# EAGLE design LED Sockel (EAGLE 7.4.0)
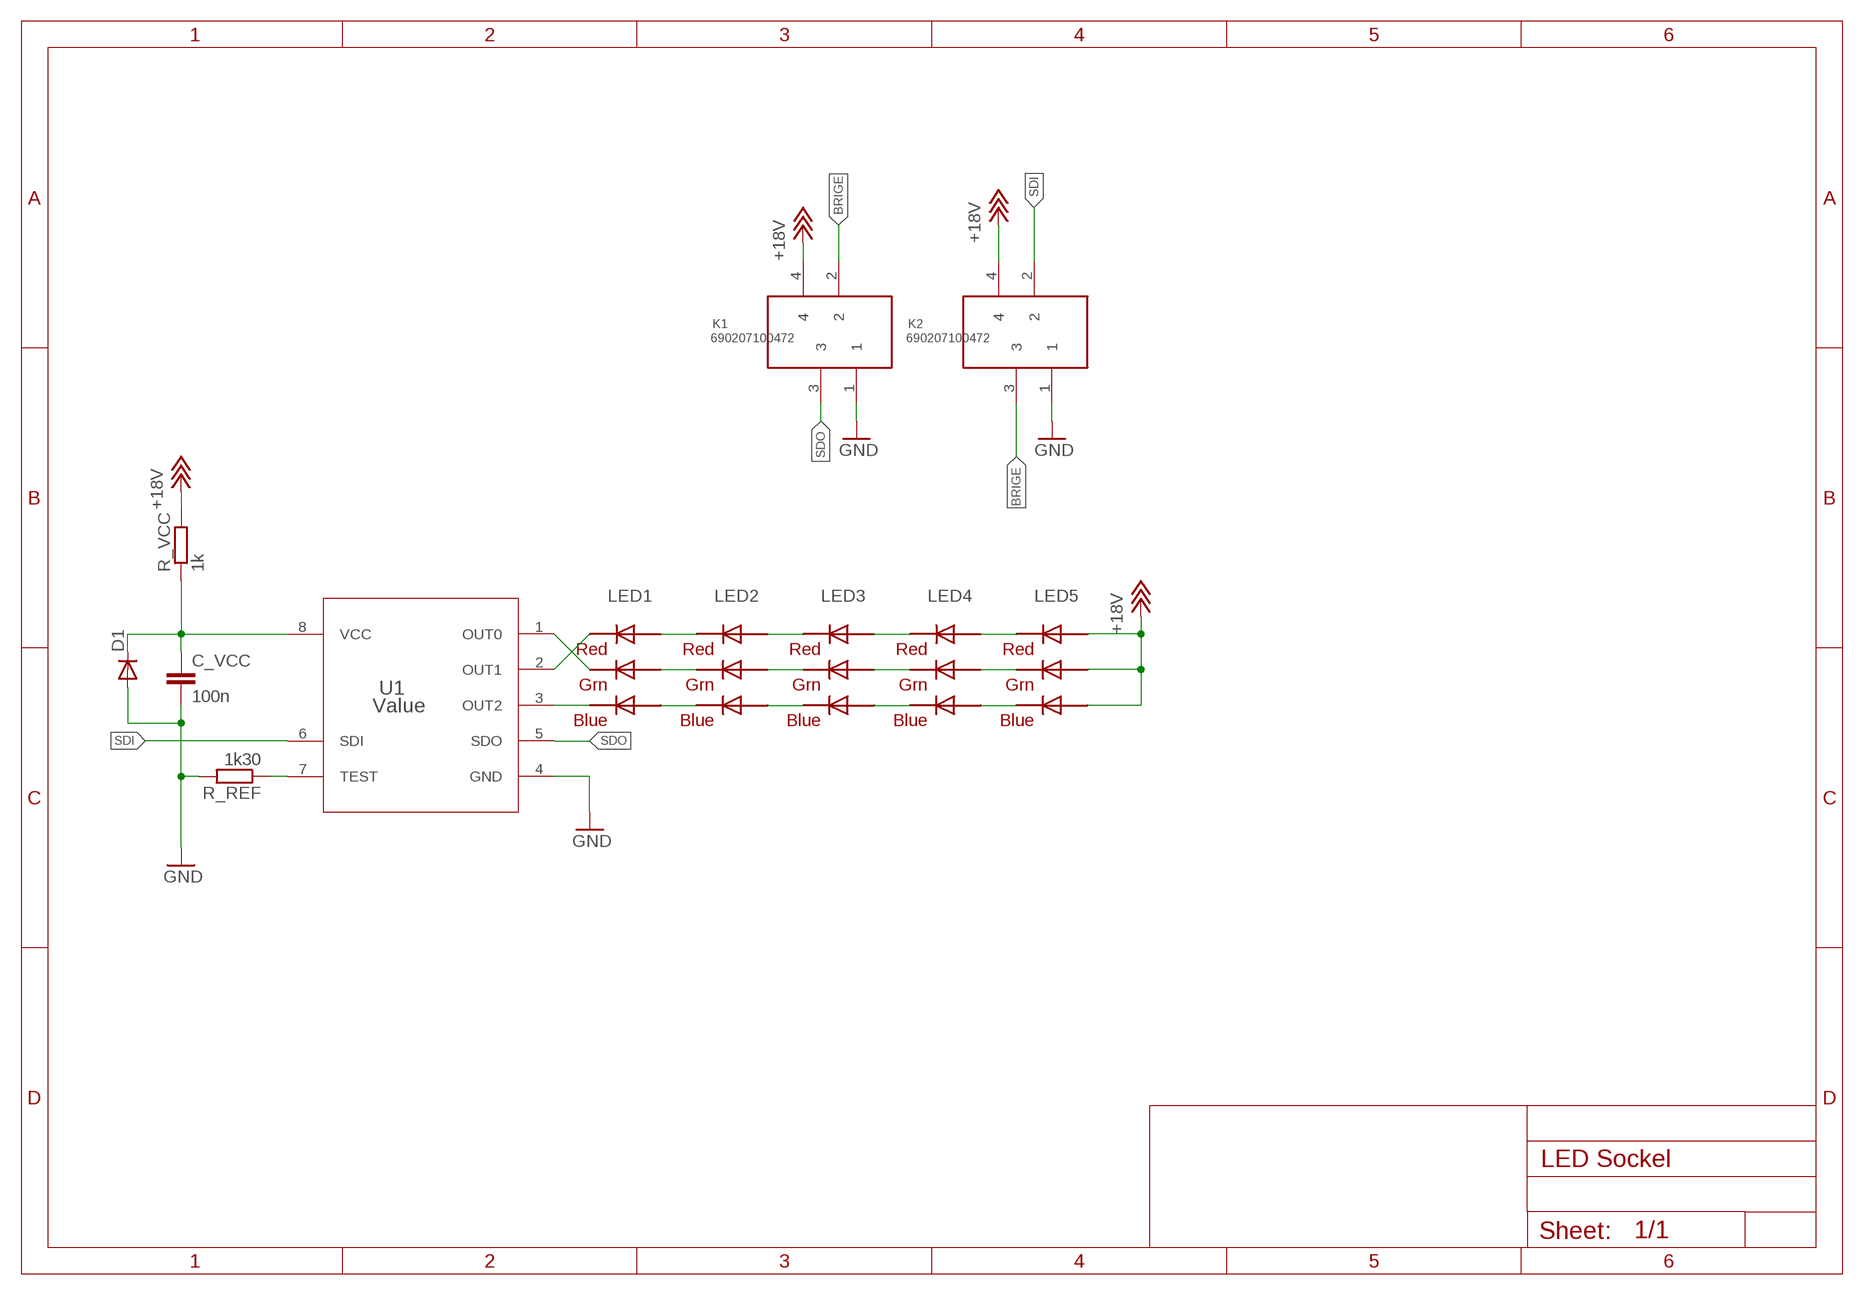
[diagram p0: schematic, sheet 1]

## Parts
C_VCC  100n  C-EUC0603  [C0603]
D1  DIODE-SOD523  [SOD523]
K1  690207100472  [690207100472]
K2  690207100472  [690207100472]
LED1  RGBLED5050  [RGBLED5050]
LED2  RGBLED5050  [RGBLED5050]
LED3  RGBLED5050  [RGBLED5050]
LED4  RGBLED5050  [RGBLED5050]
LED5  RGBLED5050  [RGBLED5050]
R_REF  1k30  R-EU_R0603  [R0603]
R_VCC  1k  R-EU_R0805  [R0805]
U1  Value  TLC59731DR  [D0008A_N]

## Nets
+18V: K1.4 K2.4 LED5.1(GREEN_A) LED5.2(RED_A) LED5.3(BLUE_A) R_VCC.2
BRIGE: K1.2 K2.3
GND: C_VCC.2 D1.A K1.1 K2.1 R_REF.2 U1.4(GND)
N$1: LED4.1(GREEN_A) LED5.6(GREEN_C)
N$2: LED4.3(BLUE_A) LED5.4(BLUE_C)
N$3: LED4.2(RED_A) LED5.5(RED_C)
N$4: LED3.1(GREEN_A) LED4.6(GREEN_C)
N$5: LED3.3(BLUE_A) LED4.4(BLUE_C)
N$6: LED3.2(RED_A) LED4.5(RED_C)
N$7: LED2.1(GREEN_A) LED3.6(GREEN_C)
N$8: LED2.3(BLUE_A) LED3.4(BLUE_C)
N$9: LED2.2(RED_A) LED3.5(RED_C)
N$10: LED1.1(GREEN_A) LED2.6(GREEN_C)
N$11: LED1.3(BLUE_A) LED2.4(BLUE_C)
N$12: LED1.2(RED_A) LED2.5(RED_C)
N$13: LED1.4(BLUE_C) U1.3(OUT2)
N$14: LED1.6(GREEN_C) U1.1(OUT0)
N$15: LED1.5(RED_C) U1.2(OUT1)
N$16: C_VCC.1 D1.C R_VCC.1 U1.8(VCC)
N$17: R_REF.1 U1.7(TEST)
SDI: K2.2 U1.6(SDI)
SDO: K1.3 U1.5(SDO)

## Library data of the parts
C_VCC = rcl:C-EU: CAPACITOR, European symbol
D1 = diode:DIODE-: DIODE
K1 K2 = Wurth_Elektronik_Electromechanic_Wire_to_Board_Connectors_rev15c:690207100472: WR-MM Transition Connector, 4 Pins=>Code : WR-MM_Leiterplattenverbinder_690207101072 <http://katalog.we-online.de/media/thumbs2/eican/thb_WR-MM_Leiterplattenverbinder_690207101072.jpg> Details see: http://katalog.we-online.de/en/em/6902_0710_xx_72 Created 2014-06-04, Karrer Zheng 2014 (C) Würth Elektronik
LED1-LED5 = adafruit:RGBLED: For 5050 RGB LEDs, the order of the LEDs may vary from one manufacturer to another!
R_REF R_VCC = rcl:R-EU_: RESISTOR, European symbol
U1 = Texas Instruments_By_element14_Batch_1:TLC59731DR; ALTERNATEPARTNUMBER: TLC59731D; APPLICATION_BUILDNUMBER: *; COMPTYPE: IC; MANUFACTURER: Texas Instruments; MOUNTTYPE: SMT; PACKAGEREFERENCE: D0008A; PARTNUMBER: TLC59731DR; PIN_COUNT: 8; REFDES: RefDes; ROHS: Y; SYMBOLVERISON: 2014-12-08; TYPE: TYPE

## Board
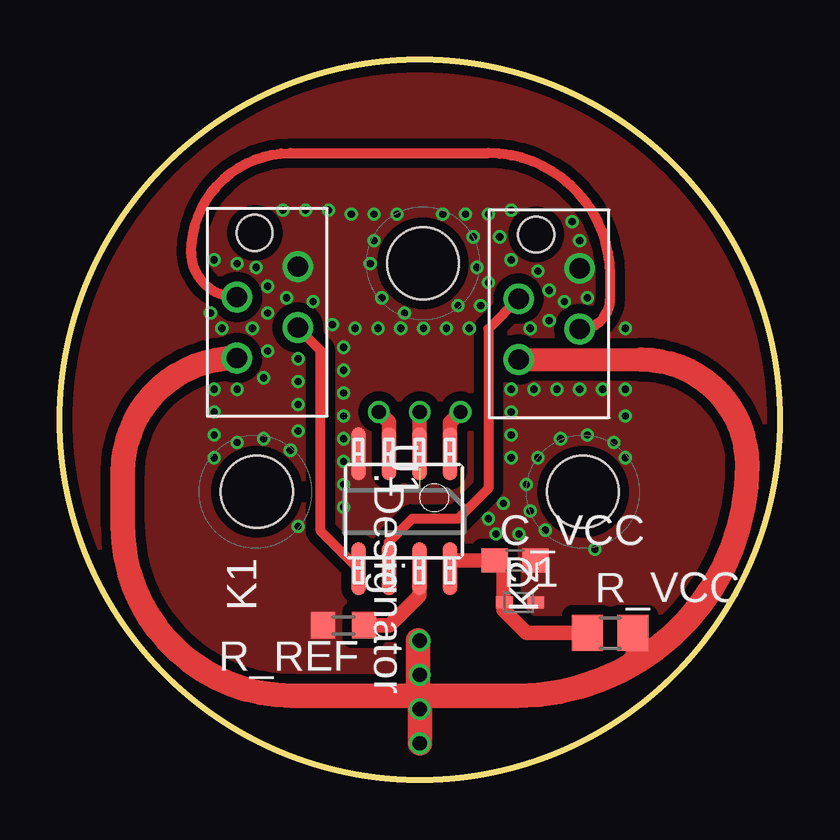
[diagram p1: board, top side]
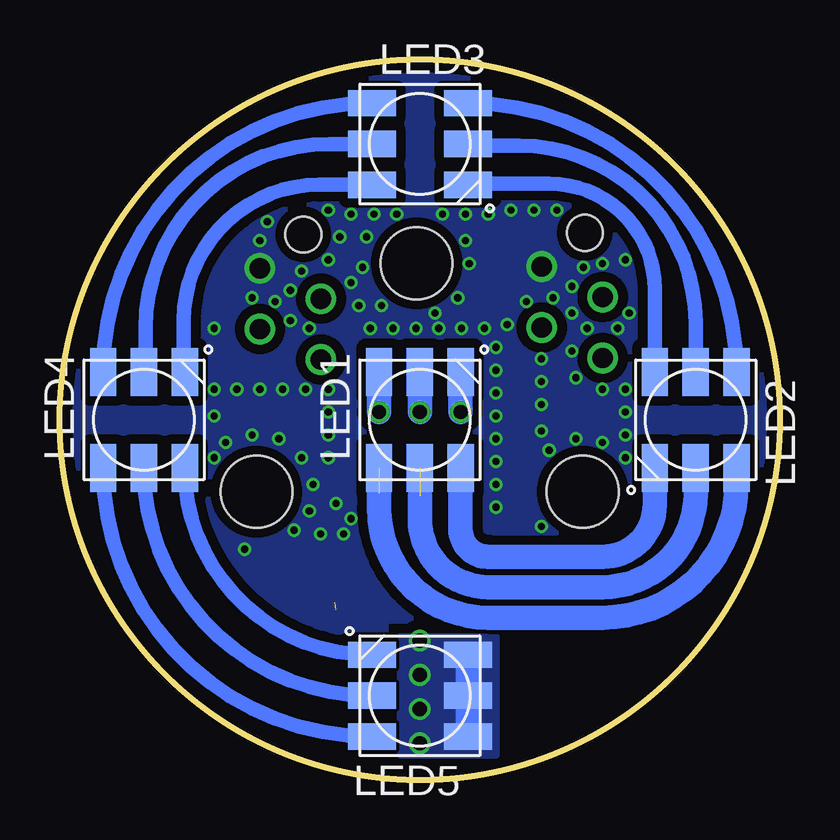
[diagram p2: board, bottom side, seen from below]

Size 30 x 30 mm. Coordinates in mm from the lower left corner, seen from the top.
Outline: circle at 15,15 radius 15
Copper layers (1*16): Top 0.018mm / dielectric 1.55mm / Bottom 0.018mm
Design rules "eC_2Layer_PClass6_BaseCopperO18_eCDefault *": minimum track width 0.15mm, minimum drill 0.3mm, track to track 0.15mm, track to pad 0.15mm, pad to pad 0.15mm, via to via 0.15mm, smd to smd 0mil, copper to edge 0.25mm, drill to drill 0.35mm, minimum pad ring 0.175mm, minimum via ring 0.125mm, stop-mask expansion 0mil, vias tented up to drill 0.45mm, thermal gap 0.2mm
Holes 3 mm at 8.2,12 21.8,12 15.13,21.53

### Footprints (pad centres in the part's own frame; a part is rotated, then mirrored left to right if it is on the bottom)
C0603 = smd 1.1 x 1: 1 -0.85,0; 2 0.85,0
SOD523 = smd 0.7 x 0.5: A 0.7,0; C -0.6,0
690207100472 = drill 0.85: 1 1.905,-1.27; 2 0.635,1.27; 3 -0.635,-1.27; 4 -1.905,1.27 | hole 1.5: 3.305,0.53
RGBLED5050 = smd 2 x 1.1: 1 -2,1.7; 2 -2,0; 3 -2,-1.7; 4 2,-1.7; 5 2,0; 6 2,1.7
R0603 = smd 1 x 1.1: 1 -0.85,0; 2 0.85,0
R0805 = smd 1.3 x 1.5: 1 -0.95,0; 2 0.95,0
D0008A_N = smd 2.21 x 0.61: 1 -2.4,1.905; 2 -2.4,0.635; 3 -2.4,-0.635; 4 -2.4,-1.905; 5 2.4,-1.905; 6 2.4,-0.635; 7 2.4,0.635; 8 2.4,1.905

### Placement (x,y rotation side)
C_VCC  18.97,9.13 0 top
D1  19.13,7.38 0 top
K1  8.64,19.48 90 top
K2  20.39,19.41 90 top
LED1  15,15 90 bottom
LED2  3.5,15 270 bottom
LED3  15,26.5 0 bottom
LED4  26.5,15 90 bottom
LED5  15,3.5 180 bottom
R_REF  11.83,6.43 180 top
R_VCC  22.94,6.11 0 top
U1  14.35,11.19 270 top

### Tracks (layer width: path | path; a pad name or v marks a point on that pad's centre or on a via)
+18V  (via drill 0.6)
  Top 0.61: 19.06,3.5 22.62,4.14 22.87,4.14 23.89,5.16 R_VCC.2
  Top 0.95: K2.4 24.24,17.51
  Top 1.016: 14.94,3.5 19.06,3.5 arc90 28.65,13.1 arc90 24.24,17.51 | 14.94,3.5 arc-90 15,3.43 v15,2.94 v15,1.51 | 14.94,3.5 14.94,5.8 | 14.94,3.5 9.68,3.5 arc-90 2.62,10.56 2.62,12.82 arc-90 K1.4
  Bottom 1.016: LED5.3 LED5.2 LED5.1
  other vias: 15,4.37 15,5.79
  pour Bottom (no thermals): 15.8,1.03 11.83,1.03 11.83,5.95 15.8,5.95
BRIGE
  Top 0.406: K2.3 arc90 22.94,20.06 22.94,21.03 arc90 17.86,26.12 9.61,26.12 arc90 5.48,21.99 arc90 7.35,20.11 K1.2
GND  (via drill 0.3)
  other vias: 6.43,13.41 7.38,14.05 8.49,14.21 9.61,13.73 9.92,10.56 22.3,9.61 20.24,10.4 19.61,11.19 19.45,12.3 19.92,13.41 20.88,14.21 21.99,14.37 23.1,14.05 23.57,13.41 23.57,16.27 23.57,15.16 22.62,16.27 21.67,16.27 20.72,16.27 19.77,16.27 18.81,16.27 18.81,15.32 18.81,14.37 18.81,13.41 18.5,11.51 17.86,10.88 18.18,10.24 19.13,10.24 6.43,14.37 6.43,15.32 6.43,16.27 7.38,16.27 8.49,16.75 8.65,17.86 8.02,18.81 9.45,20.08 6.75,18.81 6.27,19.45 6.43,21.67 7.38,21.51 8.18,21.35 8.65,20.56 8.65,19.45 9.29,23.73 10.24,23.73 11.19,23.73 12.14,23.57 13.1,23.57 14.05,23.57 15.96,23.57 16.91,23.57 17.86,23.57 18.81,23.73 10.56,19.92 11.35,18.97 11.83,18.02 11.83,17.07 11.83,16.11 11.83,15.16 11.83,14.21 11.83,13.26 11.83,12.3 11.83,11.35 12.3,18.81 13.26,18.81 14.21,18.81 15.16,18.81 16.11,18.81 17.07,18.81 17.54,19.77 17.86,20.72 13.1,22.46 12.94,21.51 13.41,20.08 14.37,19.45 16.59,19.77 17.23,22.62 17.38,21.35 21.35,23.26 21.67,22.46 18.34,22.62 18.81,21.67 19.92,21.19 21.99,20.08 21.04,19.92 20.4,19.13 19.61,18.81 20.4,20.4 23.57,18.81 9.92,14.53 9.92,15.64 9.92,16.59 9.92,17.54
  pour Bottom (isolate 0.406, rank 2, no thermals): 0,0 30,0 30,30 0,30
  pour Top (isolate 0.406, no thermals): 0,30 0,0 30,0 30,30
N$1
  Bottom 0.61: LED4.1 arc-90 LED5.6
N$2
  Bottom 0.61: LED4.3 arc-90 LED5.4
N$3
  Bottom 0.61: LED4.2 arc-90 LED5.5
N$4
  Bottom 0.61: LED3.1 arc-90 LED4.6
N$5
  Bottom 0.61: LED3.3 19.18,24.8 arc-90 24.84,19.13 24.84,17.04 arc-90 LED4.4
N$6
  Bottom 0.61: LED3.2 18.75,26.5 arc-90 26.43,18.81 26.43,17.07 arc90 LED4.5
N$7
  Bottom 0.61: LED2.1 arc-90 LED3.6
N$8
  Bottom 0.61: LED2.3 5.2,20.44 arc-90 9.61,24.84 12.96,24.84 arc-90 LED3.4
N$9
  Bottom 0.61: LED2.2 3.5,19.06 arc-90 10.87,26.43 12.93,26.43 arc90 LED3.5
N$10  (1 unrouted)
  Bottom 1.016: 16.7,11.94 16.7,11.3 arc-90 12.15,6.75 7.38,6.75 arc-90 1.8,12.33 LED2.6
N$11
  Bottom 1.016: LED1.3 13.3,10.44 arc-90 12.15,9.29 7.38,9.29 arc-90 5.2,11.47 LED2.4
N$12  (1 unrouted)
  Bottom 1.016: 15,11.82 15,10.87 arc-90 12.15,8.02 7.38,8.02 arc-90 3.5,11.9 LED2.5
N$13  (via drill 0.6)
  Top 0.61: U1.3 13.71,14.91 v13.3,15.33
  Bottom 1.016: LED1.4 v13.3,15.33
N$14  (via drill 0.6)
  Top 0.61: U1.1 16.25,14.88 v16.7,15.33
  Bottom 1.016: LED1.6 v16.7,15.33
N$15  (via drill 0.6)
  Top 0.61: U1.2 14.98,15.31 v15,15.33
  Bottom 1.016: LED1.5 v15,15.33
N$16  (1 unrouted)
  Top 0.61: U1.8 16.25,9.13 C_VCC.1 18.5,8.76 18.5,7.06 19.45,6.11 R_VCC.1
N$17
  Top 0.61: U1.7 14.98,7.68 13.73,6.43 R_REF.1
SDI
  Top 0.406: K2.2 17.86,18.79 17.86,12.15 16.59,10.87 14.68,10.87 13.71,9.9 U1.6
SDO
  Top 0.406: U1.5 10.87,10.36 10.87,17.88 K1.3